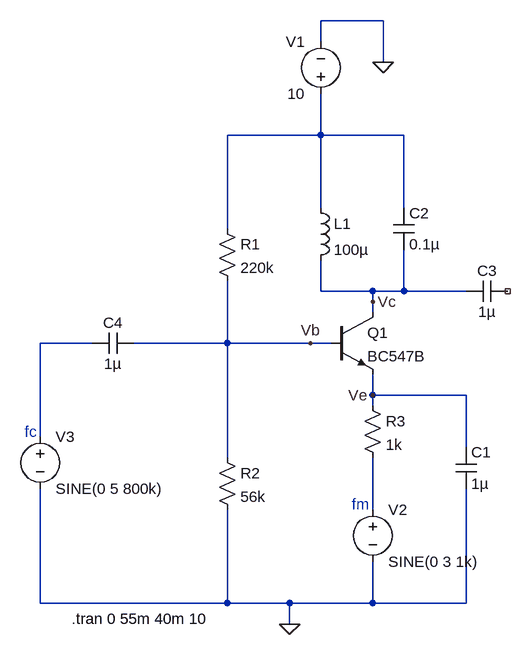
[diagram p0: schematic Draft1_modulation.asc]
Draft1_modulation.asc, the LTspice schematic file:
Version 4
SHEET 1 880 688
WIRE 304 -272 208 -272
WIRE 208 -240 208 -272
WIRE 304 -208 304 -272
WIRE 208 -96 208 -160
WIRE 208 -96 64 -96
WIRE 336 -96 208 -96
WIRE 208 16 208 -96
WIRE 336 16 336 -96
WIRE 64 48 64 -96
WIRE 208 144 208 96
WIRE 288 144 208 144
WIRE 336 144 336 80
WIRE 336 144 288 144
WIRE 432 144 336 144
WIRE 288 160 288 144
WIRE 288 176 288 160
WIRE -144 224 -224 224
WIRE 64 224 64 128
WIRE 64 224 -80 224
WIRE 192 224 64 224
WIRE 224 224 192 224
WIRE 288 304 288 272
WIRE 432 304 288 304
WIRE 288 320 288 304
WIRE -224 368 -224 224
WIRE 432 384 432 304
WIRE 64 400 64 224
WIRE 288 480 288 400
WIRE -224 624 -224 448
WIRE 64 624 64 480
WIRE 64 624 -224 624
WIRE 160 624 64 624
WIRE 288 624 288 560
WIRE 288 624 160 624
WIRE 432 624 432 448
WIRE 432 624 288 624
WIRE 160 656 160 624
FLAG 304 -208 0
FLAG 160 656 0
FLAG 288 160 Vc
FLAG 192 224 Vb
FLAG 288 304 Ve
SYMBOL res 48 32 R0
SYMATTR InstName R1
SYMATTR Value 220k
SYMBOL res 48 384 R0
SYMATTR InstName R2
SYMATTR Value 56k
SYMBOL res 272 304 R0
SYMATTR InstName R3
SYMATTR Value 1k
SYMBOL ind 192 0 R0
SYMATTR InstName L1
SYMATTR Value 100µ
SYMBOL voltage 208 -144 R180
WINDOW 0 24 96 Left 2
WINDOW 3 24 16 Left 2
WINDOW 123 0 0 Left 0
WINDOW 39 0 0 Left 0
SYMATTR InstName V1
SYMATTR Value 10
SYMBOL npn 224 176 R0
SYMATTR InstName Q1
SYMATTR Value BC547B
SYMBOL voltage 288 464 R0
WINDOW 123 0 0 Left 0
WINDOW 39 0 0 Left 0
SYMATTR InstName V2
SYMATTR Value SINE(0 3 1k)
SYMBOL voltage -224 352 R0
WINDOW 123 0 0 Left 0
WINDOW 39 0 0 Left 0
SYMATTR InstName V3
SYMATTR Value SINE(0 5 800k)
SYMBOL cap 416 384 R0
SYMATTR InstName C1
SYMATTR Value 1µ
SYMATTR SpiceLine V=16 Irms=0 Rser=11 Lser=0 mfg="AVX" pn="TAJA105K016" type="Ceramic"
SYMBOL cap 320 16 R0
SYMATTR InstName C2
SYMATTR Value 0.1µ
SYMATTR SpiceLine V=100 Irms=1.4 Rser=0.0913262 Lser=0 mfg="KEMET" pn="C0805C104K1RAC" type="X7R"
SYMBOL cap 496 128 R90
WINDOW 0 0 32 VBottom 2
WINDOW 3 32 32 VTop 2
SYMATTR InstName C3
SYMATTR Value 1µ
SYMATTR SpiceLine V=16 Irms=0 Rser=11 Lser=0 mfg="AVX" pn="TAJA105K016" type="Ceramic"
SYMBOL cap -80 208 R90
WINDOW 0 0 32 VBottom 2
WINDOW 3 32 32 VTop 2
SYMATTR InstName C4
SYMATTR Value 1µ
SYMATTR SpiceLine V=16 Irms=0 Rser=11 Lser=0 mfg="AVX" pn="TAJA105K016" type="Ceramic"
TEXT 256 472 Left 2 ;fm
TEXT -248 360 Left 2 ;fc
TEXT -176 648 Left 2 !.tran 0 55m 40m 10

The netlist it stands for:
* Draft1_modulation.asc
R1 N001 Vb 220k
R2 Vb 0 56k
R3 Ve N003 1k
L1 N001 Vc 100µ
V1 N001 0 10
Q1 Vc Vb Ve 0 BC547B
V2 N003 0 SINE(0 3 1k)
V3 N002 0 SINE(0 5 800k)
C1 Ve 0 1µ V=16 Irms=0 Rser=11 Lser=0 mfg="AVX" pn="TAJA105K016" type="Ceramic"
C2 N001 Vc 0.1µ V=100 Irms=1.4 Rser=0.0913262 Lser=0 mfg="KEMET" pn="C0805C104K1RAC" type="X7R"
C3 NC_01 Vc 1µ V=16 Irms=0 Rser=11 Lser=0 mfg="AVX" pn="TAJA105K016" type="Ceramic"
C4 Vb N002 1µ V=16 Irms=0 Rser=11 Lser=0 mfg="AVX" pn="TAJA105K016" type="Ceramic"
.model NPN NPN
.model PNP PNP
.lib standard.bjt
* fm
* fc
.tran 0 55m 40m 10
.backanno
.end